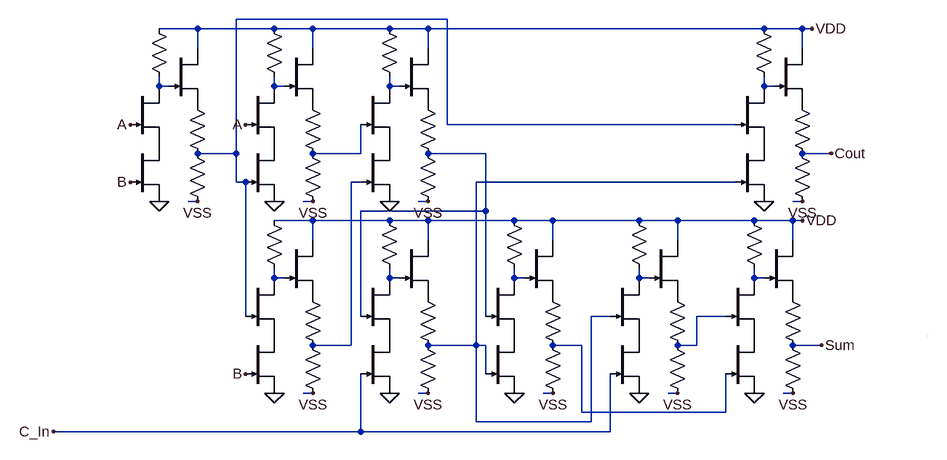
[diagram p0: schematic invertible register 2 bit.asc]
invertible register 2 bit.asc, the LTspice schematic file:
Version 4.1
SHEET 1 109444 42780
WIRE -5376 -528 -5728 -528
WIRE -5792 -512 -5856 -512
WIRE -5664 -512 -5792 -512
WIRE -5600 -512 -5664 -512
WIRE -5472 -512 -5600 -512
WIRE -5408 -512 -5472 -512
WIRE -4848 -512 -5408 -512
WIRE -4784 -512 -4848 -512
WIRE -4768 -512 -4784 -512
WIRE -5792 -480 -5792 -512
WIRE -5600 -480 -5600 -512
WIRE -5408 -480 -5408 -512
WIRE -4784 -480 -4784 -512
WIRE -5856 -416 -5856 -432
WIRE -5840 -416 -5856 -416
WIRE -5664 -416 -5664 -432
WIRE -5648 -416 -5664 -416
WIRE -5472 -416 -5472 -432
WIRE -5456 -416 -5472 -416
WIRE -4848 -416 -4848 -432
WIRE -4832 -416 -4848 -416
WIRE -5376 -352 -5376 -528
WIRE -4896 -352 -5376 -352
WIRE -5728 -304 -5728 -528
WIRE -5728 -304 -5792 -304
WIRE -5520 -304 -5520 -352
WIRE -5520 -304 -5600 -304
WIRE -5312 -304 -5408 -304
WIRE -4736 -304 -4784 -304
WIRE -5728 -256 -5728 -304
WIRE -5712 -256 -5728 -256
WIRE -5520 -256 -5536 -256
WIRE -4896 -256 -5328 -256
WIRE -5792 -224 -5808 -224
WIRE -5600 -224 -5616 -224
WIRE -5408 -224 -5424 -224
WIRE -4784 -224 -4800 -224
WIRE -5312 -208 -5312 -304
WIRE -5312 -208 -5520 -208
WIRE -5600 -192 -5664 -192
WIRE -5472 -192 -5600 -192
WIRE -5408 -192 -5472 -192
WIRE -5264 -192 -5408 -192
WIRE -5200 -192 -5264 -192
WIRE -5056 -192 -5200 -192
WIRE -4992 -192 -5056 -192
WIRE -4864 -192 -4992 -192
WIRE -4800 -192 -4864 -192
WIRE -4784 -192 -4800 -192
WIRE -5600 -160 -5600 -192
WIRE -5408 -160 -5408 -192
WIRE -5200 -160 -5200 -192
WIRE -4992 -160 -4992 -192
WIRE -4800 -160 -4800 -192
WIRE -5664 -96 -5664 -112
WIRE -5648 -96 -5664 -96
WIRE -5472 -96 -5472 -112
WIRE -5456 -96 -5472 -96
WIRE -5264 -96 -5264 -112
WIRE -5248 -96 -5264 -96
WIRE -5056 -96 -5056 -112
WIRE -5040 -96 -5056 -96
WIRE -4864 -96 -4864 -112
WIRE -4848 -96 -4864 -96
WIRE -5712 -32 -5712 -256
WIRE -5520 -32 -5520 -208
WIRE -5312 -32 -5312 -208
WIRE -5104 -32 -5136 -32
WIRE -4912 -32 -4960 -32
WIRE -5536 16 -5536 -256
WIRE -5536 16 -5600 16
WIRE -5328 16 -5328 -256
WIRE -5328 16 -5408 16
WIRE -5312 16 -5328 16
WIRE -5152 16 -5200 16
WIRE -4960 16 -4960 -32
WIRE -4960 16 -4992 16
WIRE -4752 16 -4800 16
WIRE -5312 64 -5312 16
WIRE -5600 96 -5616 96
WIRE -5408 96 -5424 96
WIRE -5200 96 -5216 96
WIRE -4992 96 -5008 96
WIRE -4800 96 -4816 96
WIRE -5152 128 -5152 16
WIRE -4912 128 -4912 64
WIRE -4912 128 -5152 128
WIRE -5328 144 -5328 16
WIRE -5136 144 -5136 -32
WIRE -5136 144 -5328 144
WIRE -5520 160 -5520 64
WIRE -5520 160 -6464 160
WIRE -5104 160 -5104 64
WIRE -5104 160 -5520 160
WIRE 0 0 0 0
FLAG -5792 -224 VSS
FLAG -5856 -224 0
FLAG -5904 -352 A
FLAG -5904 -256 B
FLAG -4768 -512 VDD
FLAG -4784 -224 VSS
FLAG -4848 -224 0
FLAG -4784 -192 VDD
FLAG -4800 96 VSS
FLAG -4864 96 0
FLAG -4992 96 VSS
FLAG -5056 96 0
FLAG -4736 -304 Cout
FLAG -4752 16 Sum
FLAG -5200 96 VSS
FLAG -5264 96 0
FLAG -5408 96 VSS
FLAG -5472 96 0
FLAG -6464 160 C_In
FLAG -5408 -224 VSS
FLAG -5472 -224 0
FLAG -5600 -224 VSS
FLAG -5664 -224 0
FLAG -5600 96 VSS
FLAG -5664 96 0
FLAG -5712 -352 A
FLAG -5712 64 B
SYMBOL res -5872 -528 R0
WINDOW 0 -35 57 Invisible 2
WINDOW 3 34 56 Invisible 2
SYMATTR InstName R3475
SYMATTR Value 100k
SYMBOL njf -5840 -480 R0
WINDOW 0 56 32 Invisible 2
WINDOW 3 56 72 Invisible 2
SYMATTR InstName J_F885
SYMATTR Value DR
SYMBOL res -5808 -400 R0
WINDOW 0 -24 60 Invisible 2
WINDOW 3 34 58 Invisible 2
SYMATTR InstName R3476
SYMATTR Value 1k
SYMBOL res -5808 -320 R0
WINDOW 0 -22 62 Invisible 2
WINDOW 3 37 62 Invisible 2
SYMATTR InstName R3477
SYMATTR Value 4.8k
SYMBOL njf -5904 -416 R0
WINDOW 0 56 32 Invisible 2
WINDOW 3 56 72 Invisible 2
SYMATTR InstName J_B1004
SYMATTR Value DR
SYMBOL njf -5904 -320 R0
WINDOW 0 56 32 Invisible 2
WINDOW 3 56 72 Invisible 2
SYMATTR InstName J_A1
SYMATTR Value DR
SYMBOL res -4864 -528 R0
WINDOW 0 -35 57 Invisible 2
WINDOW 3 34 56 Invisible 2
SYMATTR InstName R1
SYMATTR Value 100k
SYMBOL njf -4832 -480 R0
WINDOW 0 56 32 Invisible 2
WINDOW 3 56 72 Invisible 2
SYMATTR InstName J_F1
SYMATTR Value DR
SYMBOL res -4800 -400 R0
WINDOW 0 -24 60 Invisible 2
WINDOW 3 34 58 Invisible 2
SYMATTR InstName R2
SYMATTR Value 1k
SYMBOL res -4800 -320 R0
WINDOW 0 -22 62 Invisible 2
WINDOW 3 37 62 Invisible 2
SYMATTR InstName R3
SYMATTR Value 4.8k
SYMBOL njf -4896 -416 R0
WINDOW 0 56 32 Invisible 2
WINDOW 3 56 72 Invisible 2
SYMATTR InstName J_B1
SYMATTR Value DR
SYMBOL njf -4896 -320 R0
WINDOW 0 56 32 Invisible 2
WINDOW 3 56 72 Invisible 2
SYMATTR InstName J_A2
SYMATTR Value DR
SYMBOL res -4880 -208 R0
WINDOW 0 -35 57 Invisible 2
WINDOW 3 34 56 Invisible 2
SYMATTR InstName R4
SYMATTR Value 100k
SYMBOL njf -4848 -160 R0
WINDOW 0 56 32 Invisible 2
WINDOW 3 56 72 Invisible 2
SYMATTR InstName J_F2
SYMATTR Value DR
SYMBOL res -4816 -80 R0
WINDOW 0 -24 60 Invisible 2
WINDOW 3 34 58 Invisible 2
SYMATTR InstName R5
SYMATTR Value 1k
SYMBOL res -4816 0 R0
WINDOW 0 -22 62 Invisible 2
WINDOW 3 37 62 Invisible 2
SYMATTR InstName R6
SYMATTR Value 4.8k
SYMBOL njf -4912 -96 R0
WINDOW 0 56 32 Invisible 2
WINDOW 3 56 72 Invisible 2
SYMATTR InstName J_B2
SYMATTR Value DR
SYMBOL njf -4912 0 R0
WINDOW 0 56 32 Invisible 2
WINDOW 3 56 72 Invisible 2
SYMATTR InstName J_A3
SYMATTR Value DR
SYMBOL res -5072 -208 R0
WINDOW 0 -35 57 Invisible 2
WINDOW 3 34 56 Invisible 2
SYMATTR InstName R7
SYMATTR Value 100k
SYMBOL njf -5040 -160 R0
WINDOW 0 56 32 Invisible 2
WINDOW 3 56 72 Invisible 2
SYMATTR InstName J_F3
SYMATTR Value DR
SYMBOL res -5008 -80 R0
WINDOW 0 -24 60 Invisible 2
WINDOW 3 34 58 Invisible 2
SYMATTR InstName R8
SYMATTR Value 1k
SYMBOL res -5008 0 R0
WINDOW 0 -22 62 Invisible 2
WINDOW 3 37 62 Invisible 2
SYMATTR InstName R9
SYMATTR Value 4.8k
SYMBOL njf -5104 -96 R0
WINDOW 0 56 32 Invisible 2
WINDOW 3 56 72 Invisible 2
SYMATTR InstName J_B3
SYMATTR Value DR
SYMBOL njf -5104 0 R0
WINDOW 0 56 32 Invisible 2
WINDOW 3 56 72 Invisible 2
SYMATTR InstName J_A4
SYMATTR Value DR
SYMBOL res -5280 -208 R0
WINDOW 0 -35 57 Invisible 2
WINDOW 3 34 56 Invisible 2
SYMATTR InstName R10
SYMATTR Value 100k
SYMBOL njf -5248 -160 R0
WINDOW 0 56 32 Invisible 2
WINDOW 3 56 72 Invisible 2
SYMATTR InstName J_F4
SYMATTR Value DR
SYMBOL res -5216 -80 R0
WINDOW 0 -24 60 Invisible 2
WINDOW 3 34 58 Invisible 2
SYMATTR InstName R11
SYMATTR Value 1k
SYMBOL res -5216 0 R0
WINDOW 0 -22 62 Invisible 2
WINDOW 3 37 62 Invisible 2
SYMATTR InstName R12
SYMATTR Value 4.8k
SYMBOL njf -5312 -96 R0
WINDOW 0 56 32 Invisible 2
WINDOW 3 56 72 Invisible 2
SYMATTR InstName J_B4
SYMATTR Value DR
SYMBOL njf -5312 0 R0
WINDOW 0 56 32 Invisible 2
WINDOW 3 56 72 Invisible 2
SYMATTR InstName J_A5
SYMATTR Value DR
SYMBOL res -5488 -208 R0
WINDOW 0 -35 57 Invisible 2
WINDOW 3 34 56 Invisible 2
SYMATTR InstName R13
SYMATTR Value 100k
SYMBOL njf -5456 -160 R0
WINDOW 0 56 32 Invisible 2
WINDOW 3 56 72 Invisible 2
SYMATTR InstName J_F5
SYMATTR Value DR
SYMBOL res -5424 -80 R0
WINDOW 0 -24 60 Invisible 2
WINDOW 3 34 58 Invisible 2
SYMATTR InstName R14
SYMATTR Value 1k
SYMBOL res -5424 0 R0
WINDOW 0 -22 62 Invisible 2
WINDOW 3 37 62 Invisible 2
SYMATTR InstName R15
SYMATTR Value 4.8k
SYMBOL njf -5520 -96 R0
WINDOW 0 56 32 Invisible 2
WINDOW 3 56 72 Invisible 2
SYMATTR InstName J_B5
SYMATTR Value DR
SYMBOL njf -5520 0 R0
WINDOW 0 56 32 Invisible 2
WINDOW 3 56 72 Invisible 2
SYMATTR InstName J_A6
SYMATTR Value DR
SYMBOL res -5488 -528 R0
WINDOW 0 -35 57 Invisible 2
WINDOW 3 34 56 Invisible 2
SYMATTR InstName R16
SYMATTR Value 100k
SYMBOL njf -5456 -480 R0
WINDOW 0 56 32 Invisible 2
WINDOW 3 56 72 Invisible 2
SYMATTR InstName J_F6
SYMATTR Value DR
SYMBOL res -5424 -400 R0
WINDOW 0 -24 60 Invisible 2
WINDOW 3 34 58 Invisible 2
SYMATTR InstName R17
SYMATTR Value 1k
SYMBOL res -5424 -320 R0
WINDOW 0 -22 62 Invisible 2
WINDOW 3 37 62 Invisible 2
SYMATTR InstName R18
SYMATTR Value 4.8k
SYMBOL njf -5520 -416 R0
WINDOW 0 56 32 Invisible 2
WINDOW 3 56 72 Invisible 2
SYMATTR InstName J_B6
SYMATTR Value DR
SYMBOL njf -5520 -320 R0
WINDOW 0 56 32 Invisible 2
WINDOW 3 56 72 Invisible 2
SYMATTR InstName J_A7
SYMATTR Value DR
SYMBOL res -5680 -528 R0
WINDOW 0 -35 57 Invisible 2
WINDOW 3 34 56 Invisible 2
SYMATTR InstName R19
SYMATTR Value 100k
SYMBOL njf -5648 -480 R0
WINDOW 0 56 32 Invisible 2
WINDOW 3 56 72 Invisible 2
SYMATTR InstName J_F7
SYMATTR Value DR
SYMBOL res -5616 -400 R0
WINDOW 0 -24 60 Invisible 2
WINDOW 3 34 58 Invisible 2
SYMATTR InstName R20
SYMATTR Value 1k
SYMBOL res -5616 -320 R0
WINDOW 0 -22 62 Invisible 2
WINDOW 3 37 62 Invisible 2
SYMATTR InstName R21
SYMATTR Value 4.8k
SYMBOL njf -5712 -416 R0
WINDOW 0 56 32 Invisible 2
WINDOW 3 56 72 Invisible 2
SYMATTR InstName J_B7
SYMATTR Value DR
SYMBOL njf -5712 -320 R0
WINDOW 0 56 32 Invisible 2
WINDOW 3 56 72 Invisible 2
SYMATTR InstName J_A8
SYMATTR Value DR
SYMBOL res -5680 -208 R0
WINDOW 0 -35 57 Invisible 2
WINDOW 3 34 56 Invisible 2
SYMATTR InstName R22
SYMATTR Value 100k
SYMBOL njf -5648 -160 R0
WINDOW 0 56 32 Invisible 2
WINDOW 3 56 72 Invisible 2
SYMATTR InstName J_F8
SYMATTR Value DR
SYMBOL res -5616 -80 R0
WINDOW 0 -24 60 Invisible 2
WINDOW 3 34 58 Invisible 2
SYMATTR InstName R23
SYMATTR Value 1k
SYMBOL res -5616 0 R0
WINDOW 0 -22 62 Invisible 2
WINDOW 3 37 62 Invisible 2
SYMATTR InstName R24
SYMATTR Value 4.8k
SYMBOL njf -5712 -96 R0
WINDOW 0 56 32 Invisible 2
WINDOW 3 56 72 Invisible 2
SYMATTR InstName J_B8
SYMATTR Value DR
SYMBOL njf -5712 0 R0
WINDOW 0 56 32 Invisible 2
WINDOW 3 56 72 Invisible 2
SYMATTR InstName J_A9
SYMATTR Value DR

The netlist it stands for:
* invertible register 2 bit.asc
R3475 VDD N002 100k
J_F885 VDD N002 P001 DR
R3476 P001 N001 1k
R3477 N001 VSS 4.8k
J_B1004 N002 A P002 DR
J_A1 P002 B 0 DR
R1 VDD N005 100k
J_F1 VDD N005 P003 DR
R2 P003 Cout 1k
R3 Cout VSS 4.8k
J_B1 N005 N001 P004 DR
J_A2 P004 N009 0 DR
R4 VDD N014 100k
J_F2 VDD N014 P005 DR
R5 P005 Sum 1k
R6 Sum VSS 4.8k
J_B2 N014 N015 P006 DR
J_A3 P006 N016 0 DR
R7 VDD N013 100k
J_F3 VDD N013 P007 DR
R8 P007 N015 1k
R9 N015 VSS 4.8k
J_B3 N013 N009 P008 DR
J_A4 P008 C_In 0 DR
R10 VDD N012 100k
J_F4 VDD N012 P009 DR
R11 P009 N016 1k
R12 N016 VSS 4.8k
J_B4 N012 N007 P010 DR
J_A5 P010 N009 0 DR
R13 VDD N011 100k
J_F5 VDD N011 P011 DR
R14 P011 N009 1k
R15 N009 VSS 4.8k
J_B5 N011 N007 P012 DR
J_A6 P012 C_In 0 DR
R16 VDD N004 100k
J_F6 VDD N004 P013 DR
R17 P013 N007 1k
R18 N007 VSS 4.8k
J_B6 N004 N006 P014 DR
J_A7 P014 N008 0 DR
R19 VDD N003 100k
J_F7 VDD N003 P015 DR
R20 P015 N006 1k
R21 N006 VSS 4.8k
J_B7 N003 A P016 DR
J_A8 P016 N001 0 DR
R22 VDD N010 100k
J_F8 VDD N010 P017 DR
R23 P017 N008 1k
R24 N008 VSS 4.8k
J_B8 N010 N001 P018 DR
J_A9 P018 B 0 DR
.model NJF NJF
.model PJF PJF
.lib standard.jft
.backanno
.end